# Altium project LC79D_GNSSreceiver.PrjPcb (part 3 of 3)
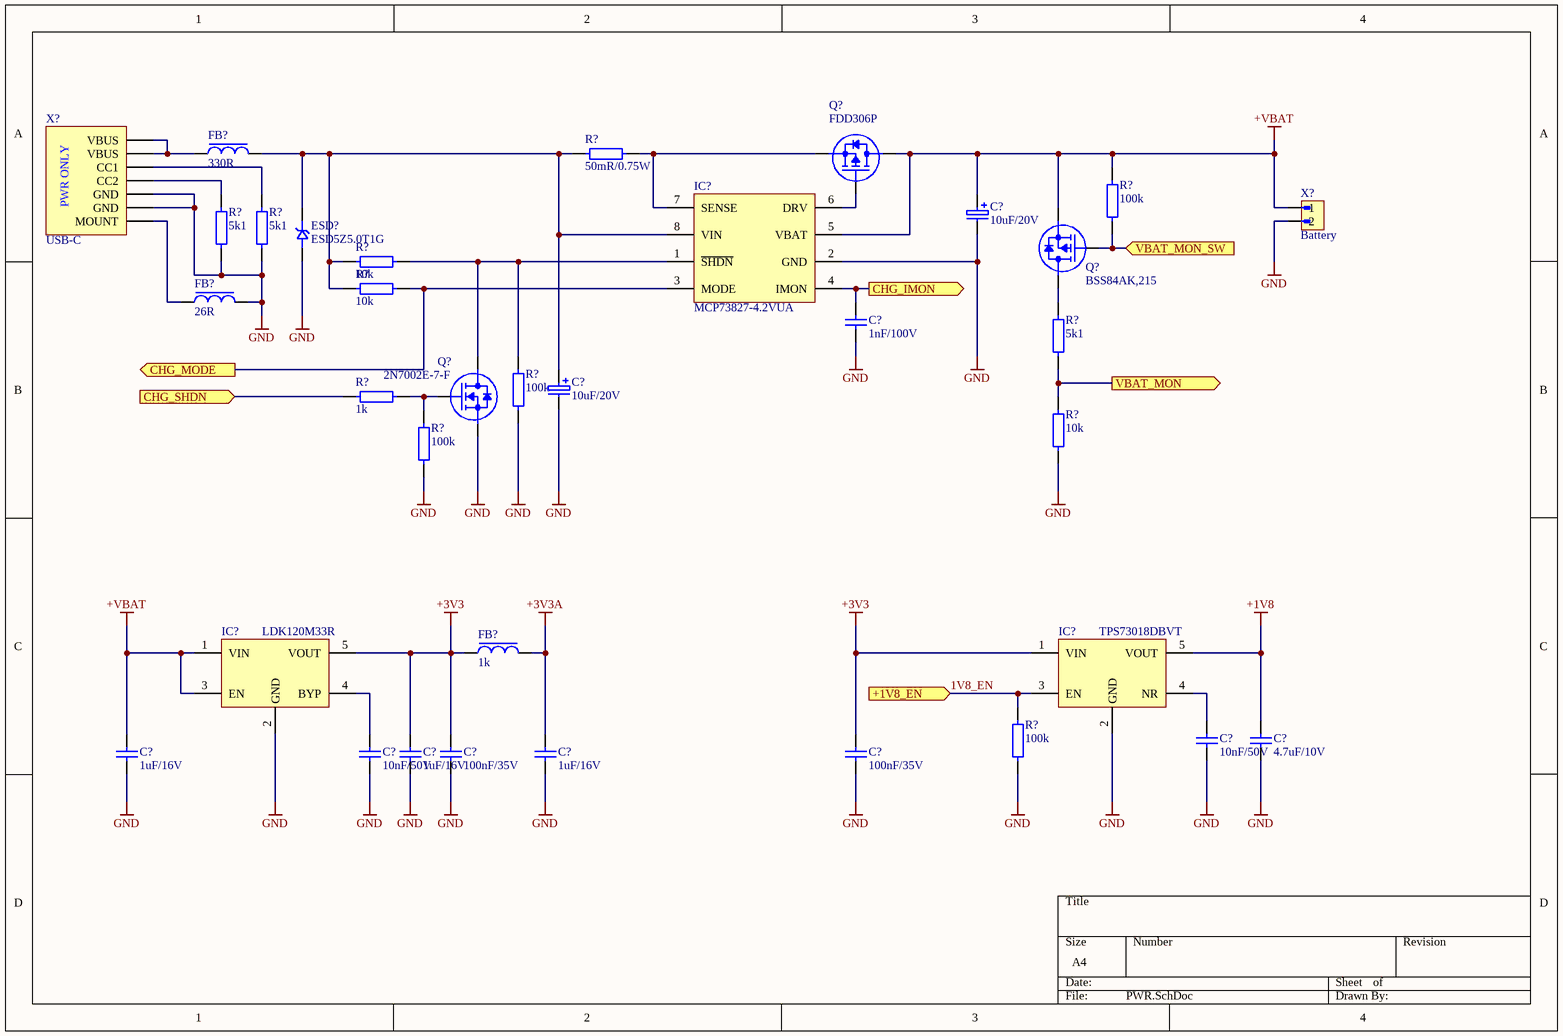
[diagram p4: PWR.SchDoc]

## Sheet PWR.SchDoc (continued)

### Library data of the parts (continued)
R?#13 = CR0603-FX-1001ELF: BOURNS - CR0603-FX-1001ELF - SMD Chip Resistor, 0603 [1608 Metric], 1 kohm, CR Series, 50 V, Thick Film, 100 mW; Manufacturer Series: CR0603; Resistance: 1kR; Tolerance: 1%; Temperature Coefficient: 100ppm/°C; Power Rating: 100mW; Voltage Rating: 50V; Manufacturer: Bourns; Manufacturer Part Number: CR0603-FX-1001ELF; RoHS: Yes; Category: Chip SMD Resistors; Stock 1: 461544; Pricing 1: 1=0,10000, 10=0,01700, 100=0,00680, 1000=0,00305, 2500=0,00264 (USD); Mount: Surface Mount; Case/Package: 0603; Number of Pins: 2; Contact Plating: Tin; Case Code (Metric): 1608; Case Code (Imperial): 0603; Package Shape: Rectangular; Size Code: 0603; Terminal Finish: Tin; Min Operating Temperature: -55°C; Max Operating Temperature: 155°C; Resistor Type: Thick Film; Packaging: Tape and Reel; Package Quantity: 1; Number of Terminations: 2; Termination: SMD/SMT; Max Power Dissipation: 100mW; Voltage Rating (DC): 50V; Features: Moisture Resistant; Series: CR0603; Resistance Tolerance: 1%; Technology: THICK FILM; Construction: Rectangular; Working Voltage: 50V; Length: 1.6mm; Width: 0.8mm; Height: 0.45mm; Depth: 0.8mm; Thickness: 457um; Radiation Hardening: No; REACH SVHC: No SVHC; Military Standard: Not; RoHS Compliant: Yes; ComponentLink1URL: https://datasheet.ciiva.com/11808/0900766b80fcdb72-11808035.pdf?src-supplier=RSComponents; ComponentLink1Description: https://datasheet.ciiva.com/11808/0900766b80fcdb72-11808035.pdf?src-supplier=RSComponents; ComponentLink2URL: https://datasheet.ciiva.com/19466/774882-19466523.pdf?src-supplier=Jameco; ComponentLink2Description: https://datasheet.ciiva.com/19466/774882-19466523.pdf?src-supplier=Jameco; ComponentLink3URL: https://datasheet.ciiva.com/6547/chpreztr-6547349.pdf?src-supplier=Digi-Key; ComponentLink3Description: https://datasheet.ciiva.com/6547/chpreztr-6547349.pdf?src-supplier=Digi-Key; ComponentLink4URL: https://datasheet.ciiva.com/16941/chpreztr-16941637.pdf?src-supplier=Avnet+Europe; ComponentLink4Description: https://datasheet.ciiva.com/16941/chpreztr-16941637.pdf?src-supplier=Avnet+Europe; ComponentLink5URL: https://datasheet.ciiva.com/22693/1902866-22693205.pdf?src-supplier=Element14; ComponentLink5Description: https://datasheet.ciiva.com/22693/1902866-22693205.pdf?src-supplier=Element14; ComponentLink6URL: https://datasheet.ciiva.com/6547/chpreztr-6547350.pdf?src-supplier=Digi-Key; ComponentLink6Description: https://datasheet.ciiva.com/6547/chpreztr-6547350.pdf?src-supplier=Digi-Key; ComponentLink7URL: https://datasheet.ciiva.com/7001/1902866-7001622.pdf?src-supplier=Newark; ComponentLink7Description: https://datasheet.ciiva.com/7001/1902866-7001622.pdf?src-supplier=Newark; ComponentLink8URL: https://datasheet.ciiva.com/30115/159chpreztr-30115222.pdf?src-supplier=Onlinecomponents.com; ComponentLink8Description: https://datasheet.ciiva.com/30115/159chpreztr-30115222.pdf?src-supplier=Onlinecomponents.com; ComponentLink9URL: https://datasheet.ciiva.com/6547/chpreztr-6547351.pdf?src-supplier=Digi-Key; ComponentLink9Description: https://datasheet.ciiva.com/6547/chpreztr-6547351.pdf?src-supplier=Digi-Key; ComponentLink10URL: https://datasheet.ciiva.com/16757/70154685-16757482.pdf?src-supplier=Allied+Electronics; ComponentLink10Description: https://datasheet.ciiva.com/16757/70154685-16757482.pdf?src-supplier=Allied+Electronics; ComponentLink11URL: https://datasheet.ciiva.com/5546/chpreztr-5546283.pdf?src-supplier=Mouser; ComponentLink11Description: https://datasheet.ciiva.com/5546/chpreztr-5546283.pdf?src-supplier=Mouser; ComponentLink12URL: https://datasheet.ciiva.com/7986/691949-7986156.pdf?src-supplier=Element14; ComponentLink12Description: https://datasheet.ciiva.com/7986/691949-7986156.pdf?src-supplier=Element14; ComponentLink13URL: https://datasheet.ciiva.com/3255/chpreztr-3255917.pdf?src-supplier=Avnet; ComponentLink13Description: https://datasheet.ciiva.com/3255/chpreztr-3255917.pdf?src-supplier=Avnet; Supplier 1: Digi-Key; Supplier 2: Mouser; Supplier 3: Farnell; Supplier Part Number 1: CR0603-FX-1001ELFCT-ND; Supplier Part Number 2: 652-CR0603FX-1001ELF; Supplier Part Number 3: 2691848
X?#1 = KUSBX-SMT-CS-6-BTR: USB Connectors USB TYPE C RCPT SMT 6PIN; Manufacturer: Kycon; Supplier 1: Mouser; Manufacturer Part Number: KUSBX-SMT-CS-6-BTR; RoHS: No; Stock 1: 580; Pricing 1: 1=0,86000, 10=0,68100, 50=0,68100, 100=0,59200, 1000=0,47300, 10000=0,38400 (USD); Supplier 2: Digi-Key; Supplier Part Number 1: 806-KUSBX-SMTCS6-BTR; Supplier Part Number 2: 2092-KUSBX-SMT-CS-6-BCT-ND
X?#2 = B2B-XH-A(LF)(SN): Conn Shrouded Header (4 Sides) HDR 2 POS 2.5mm Solder ST Thru-Hole Box; Manufacturer: JST; Number of Positions: 2; Connector Type: Male Pin; Contact Resistance: 20mR; Max Current Rating: 3A; Max Voltage Rating (AC): 250V; Insulation Resistance: 1GR; Wire/Cable Gauge: 22AWG; Supplier 1: Farnell; Manufacturer Part Number: B2B-XH-A(LF)(SN); RoHS: Yes; Category: FFC / FPC; Pricing 1: 100=0,071800, 1000=0,052000, 2500=0,048300, 5000=0,044500, 10000=0,043400 (GBP); Mount: Through Hole; Contact Plating: Tin,Copper,Lead; Color: Natural; Contact Material: Brass; Housing Material: Polyamide; Housing Color: White; Min Operating Temperature: -25°C; Max Operating Temperature: 85°C; Termination: Solder; Number of Rows: 1; Packaging: Bulk; Fastening Type: Detent; Orientation: Straight; Current Rating: 3A; Voltage Rating: 250V; Voltage Rating (AC): 250V; Number of Contacts: 2; Max Voltage Rating (DC): 250V; Length: 7.4mm; Pitch: 2.5mm; Depth: 5.75mm; Lead Pitch: 2.5mm; Lead Free: Lead Free; REACH SVHC: No SVHC; ComponentLink1URL: https://datasheet.ciiva.com/26894/getdatasheetpartid-640357-26894434.pdf?src-supplier=Verical; ComponentLink1Description: https://datasheet.ciiva.com/26894/getdatasheetpartid-640357-26894434.pdf?src-supplier=Verical; ComponentLink2URL: https://datasheet.ciiva.com/11746/0900766b8082653e-11746979.pdf?src-supplier=RSComponents; ComponentLink2Description: https://datasheet.ciiva.com/11746/0900766b8082653e-11746979.pdf?src-supplier=RSComponents; ComponentLink3URL: https://datasheet.ciiva.com/26894/getdatasheetpartid-385291-26894760.pdf?src-supplier=Verical; ComponentLink3Description: https://datasheet.ciiva.com/26894/getdatasheetpartid-385291-26894760.pdf?src-supplier=Verical; ComponentLink4URL: https://datasheet.ciiva.com/8052/5448-8052024.pdf?src-supplier=Element14; ComponentLink4Description: https://datasheet.ciiva.com/8052/5448-8052024.pdf?src-supplier=Element14; ComponentLink5URL: https://datasheet.ciiva.com/20207/523653-20207167.pdf?src-supplier=Rapid+Electronics; ComponentLink5Description: https://datasheet.ciiva.com/20207/523653-20207167.pdf?src-supplier=Rapid+Electronics; Supplier Part Number 1: 1516276

### Notes on the sheet
- (in symbol KUSBX-SMT-CS-6-BTR) PWR ONLY

## Sheet MCU.SchDoc
size A4; SheetNumber: 3; SheetTotal: 3
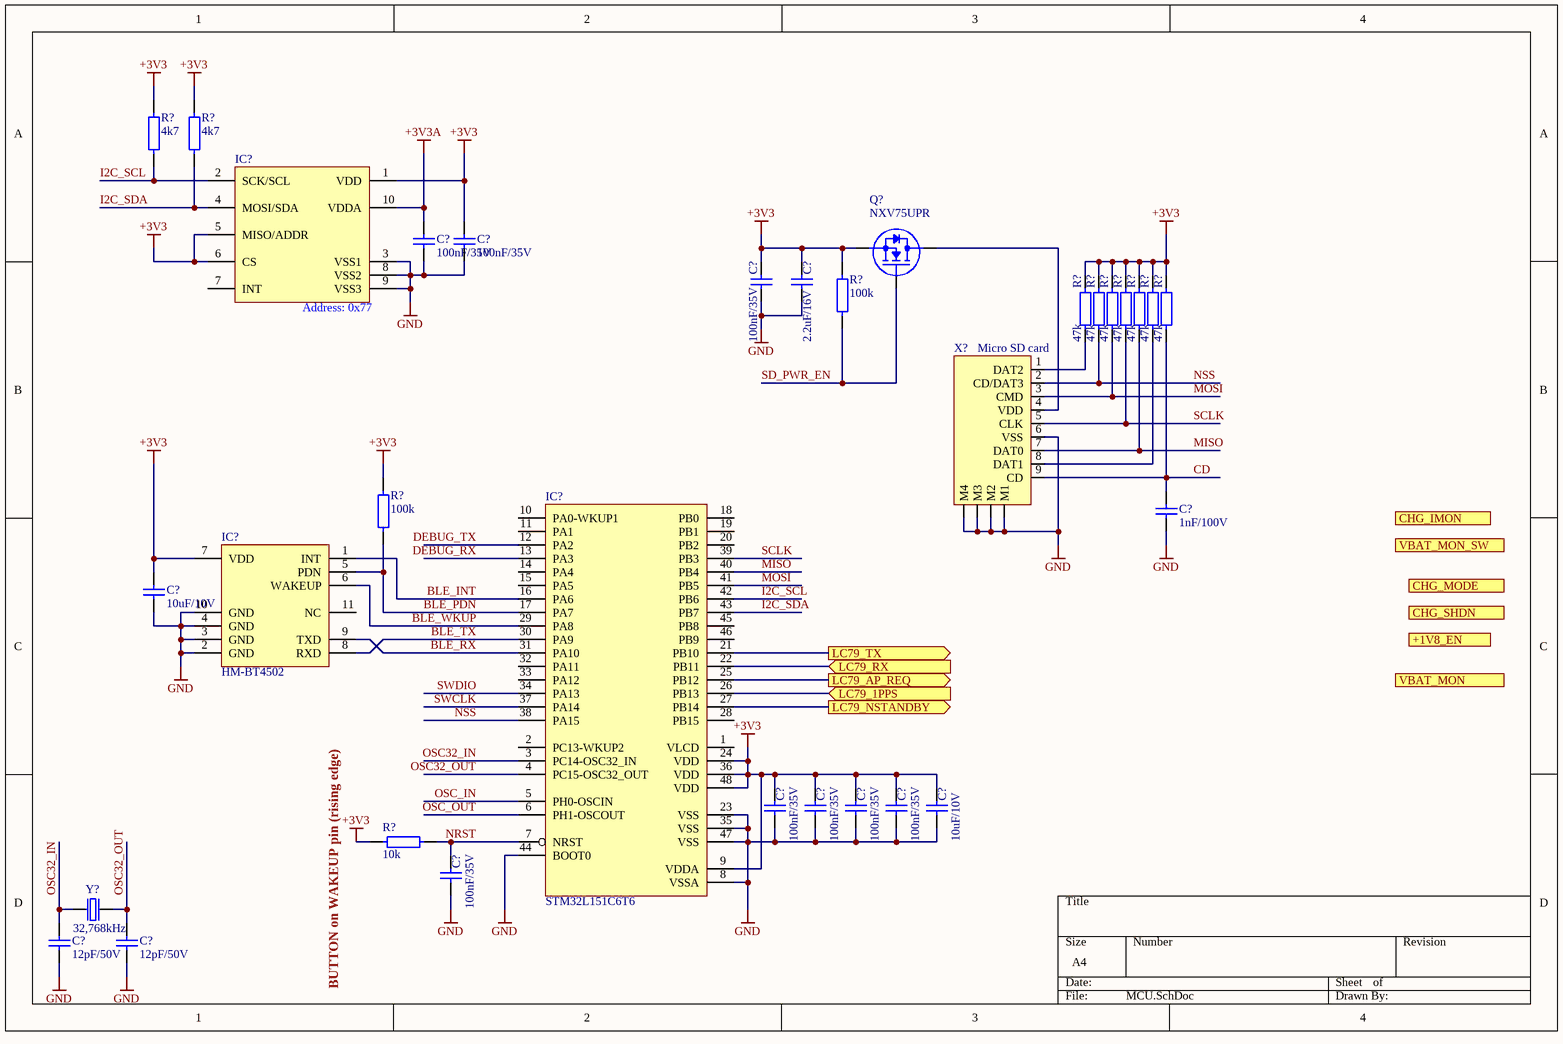
[diagram p2: MCU.SchDoc]

### Parts
(Parts that share a designator on the sheet are numbered #1, #2 ... from top to bottom, then left to right.)
C?#19  100nF/35V  [C0603]
C?#20  100nF/35V  [C0603]
C?#21  100nF/35V  [C0603]
C?#22  2.2uF/16V  [C0603]
C?#23  1nF/100V  [C0603]
C?#24  10uF/10V  [C0603]
C?#25  100nF/35V  [C0603]
C?#26  100nF/35V  [C0603]
C?#27  100nF/35V  [C0603]
C?#28  100nF/35V  [C0603]
C?#29  10uF/10V  [C0603]
C?#30  100nF/35V  [C0603]
C?#31  12pF/50V  [C0603]
C?#32  12pF/50V  [C0603]
IC?#6  (no value)  [LGA10]
IC?#7  STM32L151C6T6  [LQFP48]
IC?#8  HM-BT4502  [HM-BT450X]
Q?#5  NXV75UPR  [SOT23-3]
R?#18  4k7  [R0603]
R?#19  4k7  [R0603]
R?#20  100k  [R0603]
R?#21  47k  [R0603]
R?#22  47k  [R0603]
R?#23  47k  [R0603]
R?#24  47k  [R0603]
R?#25  47k  [R0603]
R?#26  47k  [R0603]
R?#27  47k  [R0603]
R?#28  100k  [R0603]
R?#29  10k  [r0603]
X?#3  Micro SD card  [MicroSD pull-slot]
Y?  32,768kHz  [FC135]

### Ports
+1V8_EN (in), CHG_IMON (out), CHG_MODE (out), CHG_SHDN (in), LC79_1PPS (in), LC79_AP_REQ (out), LC79_NSTANDBY (out), LC79_RX (in), LC79_TX (out), VBAT_MON (out), VBAT_MON_SW (in)

### Nets
+3V3: C?#20.2 C?#21.2 C?#22.2 C?#24.2 C?#25.2 C?#26.2 C?#27.2 C?#28.2 C?#29.2 IC?#6.1(VDD) IC?#6.5(MISO/ADDR) IC?#6.6(CS) IC?#7.9(VDDA) IC?#7.24(VDD) IC?#7.36(VDD) IC?#7.48(VDD) IC?#8.7(VDD) Q?#5.2(S) R?#18.1 R?#19.1 R?#20.1 R?#21.2 R?#22.2 R?#23.2 R?#24.2 R?#25.2 R?#26.2 R?#27.2 R?#28.2 R?#29.1
+3V3A: C?#19.2 IC?#6.10(VDDA)
GND: C?#19.1 C?#20.1 C?#21.1 C?#22.1 C?#23.1 C?#24.1 C?#25.1 C?#26.1 C?#27.1 C?#28.1 C?#29.1 C?#30.1 C?#31.1 C?#32.1 IC?#6.3(VSS1) IC?#6.8(VSS2) IC?#6.9(VSS3) IC?#7.8(VSSA) IC?#7.23(VSS) IC?#7.35(VSS) IC?#7.44(BOOT0) IC?#7.47(VSS) IC?#8.2(GND) IC?#8.3(GND) IC?#8.4(GND) IC?#8.10(GND) X?#3.6(VSS) X?#3.M1 X?#3.M2 X?#3.M3 X?#3.M4
BLE_INT: IC?#7.16(PA6) IC?#8.1(INT)
BLE_PDN: IC?#7.17(PA7) IC?#8.5(PDN) R?#28.1
BLE_RX: IC?#7.31(PA10) IC?#8.9(TXD)
BLE_TX: IC?#7.30(PA9) IC?#8.8(RXD)
BLE_WKUP: IC?#7.29(PA8) IC?#8.6(WAKEUP)
CD: C?#23.2 R?#27.1 X?#3.9(CD)
DEBUG_RX: IC?#7.13(PA3)
DEBUG_TX: IC?#7.12(PA2)
I2C_SCL: IC?#6.2(SCK/SCL) IC?#7.42(PB6) R?#18.2
I2C_SDA: IC?#6.4(MOSI/SDA) IC?#7.43(PB7) R?#19.2
LC79_1PPS: IC?#7.26(PB13) ; port LC79_1PPS
LC79_AP_REQ: IC?#7.25(PB12) ; port LC79_AP_REQ
LC79_NSTANDBY: IC?#7.27(PB14) ; port LC79_NSTANDBY
LC79_RX: IC?#7.22(PB11) ; port LC79_RX
LC79_TX: IC?#7.21(PB10) ; port LC79_TX
MISO: IC?#7.40(PB4) R?#25.1 X?#3.7(DAT0)
MOSI: IC?#7.41(PB5) R?#23.1 X?#3.3(CMD)
NRST: C?#30.2 IC?#7.7(NRST) R?#29.2
NSS: IC?#7.38(PA15) R?#22.1 X?#3.2(CD/DAT3)
OSC32_IN: C?#31.2 IC?#7.3(PC14-OSC32_IN) Y?.1
OSC32_OUT: C?#32.2 IC?#7.4(PC15-OSC32_OUT) Y?.2
OSC_IN: IC?#7.5(PH0-OSCIN)
OSC_OUT: IC?#7.6(PH1-OSCOUT)
SCLK: IC?#7.39(PB3) R?#24.1 X?#3.5(CLK)
SD_PWR_EN: Q?#5.1(G) R?#20.2
SWCLK: IC?#7.37(PA14)
SWDIO: IC?#7.34(PA13)
NetQ?#5_3: Q?#5.3(D) X?#3.4(VDD)
NetR?#21_1: R?#21.1 X?#3.1(DAT2)
NetR?#26_1: R?#26.1 X?#3.8(DAT1)

Not connected (* = marked no-connect by the designer): IC?#6 7(INT); IC?#7 1(VLCD) 2(PC13-WKUP2) 10(PA0-WKUP1) 11(PA1) 14(PA4) 15(PA5) 18(PB0) 19(PB1) 20(PB2) 28(PB15) 32(PA11) 33(PA12) 45(PB8) 46(PB9); IC?#8 11(NC)

### Notes on the sheet
- (near IC?#6) Address: 0x77
- (near R?#29) BUTTON on WAKEUP pin (rising edge)

### Library data of the parts
C?#19-C?#21 C?#25-C?#28 C?#30 = 06035G104ZAT2A: CERAMIC CAPACITOR, 0.1UF, 50V, Y5V, +80,-20%, 0603, FULL REEL; Product Range:-; Capacitance:0.1 F; Capacitance Tolerance:+80%, -20%; Dielectric Characteristic:Y5V; Voltage Rating:50V; Ceramic Capacitor Case:0603 [1608 Metric] ;RoHS Compliant: Yes; Manufacturer: Kyocera AVX; Capacitance: 100nF; Tolerance: 80%; Supplier 1: Farnell; Supplier Part Number 1: 2332660; Manufacturer Part Number: 06035G104ZAT2A; RoHS: Yes; Category: Ceramic Capacitors; Stock 1: 29140; Pricing 1: 10=0,03250, 100=0,02120, 500=0,01780, 1000=0,01420, 2000=0,01220 (GBP); Mount: Surface Mount,PCB; Case/Package: 0603; Number of Pins: 2; Case Code (Metric): 1608; Case Code (Imperial): 0603; Contact Plating: Tin,Matte; Dielectric Material: Ceramic; Min Operating Temperature: -30°C; Max Operating Temperature: 85°C; Dielectric: Y5V; Packaging: Tape and Reel; Voltage Rating (DC): 50V; Voltage Rating: 50V; Package Quantity: 1; Termination: SMD/SMT; Voltage: 50V; Series: -; Construction: Flat; Length: 1.6mm; Width: 0.032inch; Height: 0.63mm; Depth: 0.81mm; Thickness: 0.035inch; Radiation Hardening: No; REACH SVHC: No SVHC; Lead Free: Lead Free; RoHS Compliant: Yes; ComponentLink1URL: https://datasheet.ciiva.com/2987/cy5v-2987860.pdf?src-supplier=Avnet; ComponentLink1Description: https://datasheet.ciiva.com/2987/cy5v-2987860.pdf?src-supplier=Avnet; ComponentLink2URL: https://datasheet.ciiva.com/16359/cy5v-16359895.pdf?src-supplier=Future+Electronics; ComponentLink2Description: https://datasheet.ciiva.com/16359/cy5v-16359895.pdf?src-supplier=Future+Electronics; ComponentLink3URL: https://datasheet.ciiva.com/28613/578190-28613048.pdf?src-supplier=Element14; ComponentLink3Description: https://datasheet.ciiva.com/28613/578190-28613048.pdf?src-supplier=Element14; ComponentLink4URL: https://datasheet.ciiva.com/151/cy5v-151545.pdf?src-supplier=Digi-Key; ComponentLink4Description: https://datasheet.ciiva.com/151/cy5v-151545.pdf?src-supplier=Digi-Key; ComponentLink5URL: https://datasheet.ciiva.com/151/cy5v-151546.pdf?src-supplier=Digi-Key; ComponentLink5Description: https://datasheet.ciiva.com/151/cy5v-151546.pdf?src-supplier=Digi-Key; ComponentLink6URL: https://datasheet.ciiva.com/151/cy5v-151547.pdf?src-supplier=Digi-Key; ComponentLink6Description: https://datasheet.ciiva.com/151/cy5v-151547.pdf?src-supplier=Digi-Key; ComponentLink7URL: https://datasheet.ciiva.com/11499/cy5v-11499710.pdf?src-supplier=Avnet; ComponentLink7Description: https://datasheet.ciiva.com/11499/cy5v-11499710.pdf?src-supplier=Avnet; Supplier 2: Mouser; Supplier Part Number 2: 581-06035G104Z; Stock 2: 97036; Pricing 2: 1=0,09000, 10=0,03300, 50=0,03300, 100=0,02700, 1000=0,01600, 10000=0,01000 (USD); Supplier 3: Digi-Key; Supplier Part Number 3: 478-3724-6-ND; Stock 3: 629269; Pricing 3: 1=0,10000, 10=0,05900, 50=0,03220, 100=0,02640, 500=0,01882, 1000=0,01479 (USD)
C?#22 = C1608X5R1C225K080AB: TDK - C1608X5R1C225K080AB - SMD Multilayer Ceramic Capacitor, 2.2 µF, 16 V, 0603 [1608 Metric], ± 10%, X5R, C Series TDK; Capacitance: 2.2uF; Voltage Rating: 16V; Manufacturer: TDK; Manufacturer Part Number: C1608X5R1C225K080AB; RoHS: Yes; Category: Ceramic Capacitors; Stock 1: 107257; Pricing 1: 1=0,19000, 10=0,12900, 50=0,07760, 100=0,06560, 500=0,04484, 1000=0,03968 (USD); Mount: Surface Mount; Case/Package: 0603; Case Code (Metric): 1608; Case Code (Imperial): 0603; Dielectric Material: Ceramic; Weight: 7.1E-05oz; Min Operating Temperature: -55°C; Max Operating Temperature: 85°C; Tolerance: 10%; Dielectric: X5R; Packaging: Tape and Reel; Voltage Rating (DC): 16V; Termination: SMD/SMT; Package Quantity: 1; Resistor Type: Ceramic; Construction: Flat; Voltage: 16V; Series: C; Length: 1.6mm; Width: 0.031inch; Height: 0.8mm; Depth: 0.8mm; Thickness: 0.035inch; Radiation Hardening: No; REACH SVHC: No SVHC; Lead Free: Lead Free; RoHS Compliant: Yes; ComponentLink1URL: https://datasheet.ciiva.com/6251/tdkmlcccaprange-6251142.pdf?src-supplier=Digi-Key; ComponentLink1Description: https://datasheet.ciiva.com/6251/tdkmlcccaprange-6251142.pdf?src-supplier=Digi-Key; ComponentLink2URL: https://datasheet.ciiva.com/28577/mlcc-commercial-general-en-28577144.pdf?src-supplier=Element14; ComponentLink2Description: https://datasheet.ciiva.com/28577/mlcc-commercial-general-en-28577144.pdf?src-supplier=Element14; ComponentLink3URL: https://datasheet.ciiva.com/26285/13mlcc-commercial-general-en-26285227.pdf?src-supplier=Onlinecomponents.com; ComponentLink3Description: https://datasheet.ciiva.com/26285/13mlcc-commercial-general-en-26285227.pdf?src-supplier=Onlinecomponents.com; ComponentLink4URL: https://datasheet.ciiva.com/22725/1913358-22725516.pdf?src-supplier=Element14; ComponentLink4Description: https://datasheet.ciiva.com/22725/1913358-22725516.pdf?src-supplier=Element14; ComponentLink5URL: https://datasheet.ciiva.com/17487/e412-c-17487517.pdf?src-supplier=Avnet+Europe; ComponentLink5Description: https://datasheet.ciiva.com/17487/e412-c-17487517.pdf?src-supplier=Avnet+Europe; ComponentLink6URL: https://datasheet.ciiva.com/23802/1796654-23802766.pdf?src-supplier=Newark; ComponentLink6Description: https://datasheet.ciiva.com/23802/1796654-23802766.pdf?src-supplier=Newark; ComponentLink7URL: https://datasheet.ciiva.com/7975/1796654-7975071.pdf?src-supplier=Element14; ComponentLink7Description: https://datasheet.ciiva.com/7975/1796654-7975071.pdf?src-supplier=Element14; Supplier 1: Digi-Key; Supplier 2: Mouser; Supplier 3: Farnell; Supplier Part Number 1: 445-5157-1-ND; Supplier Part Number 2: 810-C1608X5R1C225K-4; Supplier Part Number 3: 2211169
C?#23 = 06031C102KAT2A: Cap MLCC SMD 0603 100V X7R 1000pF 10% Commercial Ti/Sn Plated 7"T/R; Manufacturer: Kyocera AVX; Dielectric Material: Ceramic; Capacitance: 1nF; Insulation Resistance: 100GR; Dissipation Factor: 2.5%; Supplier 1: Farnell; Supplier Part Number 1: 1833874; Manufacturer Part Number: 06031C102KAT2A; RoHS: Yes; Category: Ceramic Capacitors; Stock 1: 21717; Pricing 1: 10=0,05170, 100=0,04240, 500=0,02740, 1000=0,02080, 2000=0,01750, 4000=0,01420, 20000=0,01240 (GBP); Mount: Surface Mount,PCB; Case/Package: 0603; Number of Pins: 2; Case Code (Imperial): 0603; Case Code (Metric): 1608; Contact Plating: Tin,Matte; Min Operating Temperature: -55°C; Max Operating Temperature: 125°C; Tolerance: 10%; Dielectric: X7R; Packaging: Tape and Reel; Voltage Rating (DC): 100V; Voltage Rating: 100V; Package Quantity: 1; Termination: SMD/SMT; Voltage: 100V; Length: 1.6mm; Width: 0.81mm; Height: 0.9mm; Depth: 0.81mm; Thickness: 0.035inch; Radiation Hardening: No; REACH SVHC: No SVHC; Lead Free: Lead Free; ComponentLink1URL: https://datasheet.ciiva.com/2987/cx7r-2987733.pdf?src-supplier=Avnet; ComponentLink1Description: https://datasheet.ciiva.com/2987/cx7r-2987733.pdf?src-supplier=Avnet; ComponentLink2URL: https://datasheet.ciiva.com/7855/84526-7855189.pdf?src-supplier=Element14; ComponentLink2Description: https://datasheet.ciiva.com/7855/84526-7855189.pdf?src-supplier=Element14; ComponentLink3URL: https://datasheet.ciiva.com/11499/cx7r-11499669.pdf?src-supplier=Avnet; ComponentLink3Description: https://datasheet.ciiva.com/11499/cx7r-11499669.pdf?src-supplier=Avnet; ComponentLink4URL: https://datasheet.ciiva.com/1124/1679506-1124198.pdf?src-supplier=Element14; ComponentLink4Description: https://datasheet.ciiva.com/1124/1679506-1124198.pdf?src-supplier=Element14; ComponentLink5URL: https://datasheet.ciiva.com/16289/cx7r-16289400.pdf?src-supplier=Future+Electronics; ComponentLink5Description: https://datasheet.ciiva.com/16289/cx7r-16289400.pdf?src-supplier=Future+Electronics; ComponentLink6URL: https://datasheet.ciiva.com/5422/cx7r-218113-5422905.pdf?src-supplier=Mouser; ComponentLink6Description: https://datasheet.ciiva.com/5422/cx7r-218113-5422905.pdf?src-supplier=Mouser; ComponentLink7URL: https://datasheet.ciiva.com/7855/1679506-7855033.pdf?src-supplier=Element14; ComponentLink7Description: https://datasheet.ciiva.com/7855/1679506-7855033.pdf?src-supplier=Element14; ComponentLink8URL: https://datasheet.ciiva.com/150/cx7r-150395.pdf?src-supplier=Digi-Key; ComponentLink8Description: https://datasheet.ciiva.com/150/cx7r-150395.pdf?src-supplier=Digi-Key; ComponentLink9URL: https://datasheet.ciiva.com/22693/1679506-22693579.pdf?src-supplier=Element14; ComponentLink9Description: https://datasheet.ciiva.com/22693/1679506-22693579.pdf?src-supplier=Element14; ComponentLink10URL: https://datasheet.ciiva.com/150/cx7r-150396.pdf?src-supplier=Digi-Key; ComponentLink10Description: https://datasheet.ciiva.com/150/cx7r-150396.pdf?src-supplier=Digi-Key; ComponentLink11URL: https://datasheet.ciiva.com/14600/70001075-14600988.pdf?src-supplier=Allied+Electronics; ComponentLink11Description: https://datasheet.ciiva.com/14600/70001075-14600988.pdf?src-supplier=Allied+Electronics; ComponentLink12URL: https://datasheet.ciiva.com/150/cx7r-150397.pdf?src-supplier=Digi-Key; ComponentLink12Description: https://datasheet.ciiva.com/150/cx7r-150397.pdf?src-supplier=Digi-Key; ComponentLink13URL: https://datasheet.ciiva.com/14594/70001075-14594623.pdf?src-supplier=Allied+Electronics; ComponentLink13Description: https://datasheet.ciiva.com/14594/70001075-14594623.pdf?src-supplier=Allied+Electronics; ComponentLink14URL: https://datasheet.ciiva.com/16484/cx7r-16484383.pdf?src-supplier=Avnet+Asia; ComponentLink14Description: https://datasheet.ciiva.com/16484/cx7r-16484383.pdf?src-supplier=Avnet+Asia
C?#24 C?#29 = LMK107BBJ106MALT: TAIYO YUDEN - LMK107BBJ106MALT - CAPACITOR, MLCC, X5R, 10UF, 10V, 0603, REEL, FULL REEL; Tolerance: 20%; Supplier 1: Farnell; Supplier Part Number 1: 2113070; Manufacturer: Taiyo Yuden; Manufacturer Part Number: LMK107BBJ106MALT; RoHS: Yes; Category: Ceramic Capacitors; Stock 1: 9135; Pricing 1: 10=0,08050, 100=0,04970, 500=0,03510, 1000=0,03060, 2000=0,02970, 4000=0,02430, 20000=0,01840 (GBP); Mount: Surface Mount; Case/Package: 0603; Case Code (Imperial): 0603; Case Code (Metric): 1608; Min Operating Temperature: -55°C; Max Operating Temperature: 85°C; Termination: SMD/SMT; Resistor Type: Ceramic; Package Quantity: 1; Voltage Rating: 10V; Voltage Rating (DC): 10V; Packaging: Tape and Reel; Capacitance: 10uF; Dielectric: X5R; Voltage: 10V; Length: 1.6mm; Width: 0.8mm; Height: 0.8mm; Thickness: 0.035inch; Depth: 0.8mm; Radiation Hardening: No; REACH SVHC: Unknown; Lead Free: Lead Free; ComponentLink1URL: https://datasheet.ciiva.com/11596/lmk107bbj106malt-ss-11596989.pdf?src-supplier=Avnet; ComponentLink1Description: https://datasheet.ciiva.com/11596/lmk107bbj106malt-ss-11596989.pdf?src-supplier=Avnet; ComponentLink2URL: https://datasheet.ciiva.com/26872/getdatasheetpartid-637524-26872634.pdf?src-supplier=Verical; ComponentLink2Description: https://datasheet.ciiva.com/26872/getdatasheetpartid-637524-26872634.pdf?src-supplier=Verical
C?#31 C?#32 = C0603C120J5GACTU: Capacitor; Ceramic; Cap; 12.0pF; Tol 5%; SMT; Vol-Rtg 50V; C0G; Manufacturer: KEMET; Capacitance: 12pF; Temperature Coefficient: 30ppm/°C; Supplier 1: Digi-Key; Manufacturer Part Number: C0603C120J5GACTU; RoHS: Yes; Category: Ceramic Capacitors; Stock 1: 65599; Pricing 1: 1=0,10000, 10=0,05600, 50=0,03040, 100=0,02480, 500=0,01772, 1000=0,01392 (USD); Mount: Surface Mount,PCB; Case/Package: 0603; Number of Pins: 2; Dielectric Material: Ceramic; Contact Material: Tin; Case Code (Imperial): 0603; Case Code (Metric): 1608; Weight: 7.1E-05oz; Min Operating Temperature: -55°C; Max Operating Temperature: 125°C; Tolerance: 5%; Packaging: Tape and Reel; Dielectric: C0G; Voltage: 50V; Termination: SMD/SMT; Voltage Rating (DC): 50V; Package Quantity: 1; Series: C; Voltage Rating: 50V; Construction: Flat; Length: 1.6mm; Width: 0.8mm; Height: 0.8mm; Depth: 0.8mm; Thickness: 0.034inch; Lead Pitch: 0.7mm; Radiation Hardening: No; Lead Free: Lead Free; REACH SVHC: No SVHC; ComponentLink1URL: https://datasheet.ciiva.com/28608/1372242-28608539.pdf?src-supplier=Element14; ComponentLink1Description: https://datasheet.ciiva.com/28608/1372242-28608539.pdf?src-supplier=Element14; Supplier 2: Mouser; Supplier 3: Farnell; Supplier 4: TME; Supplier Part Number 1: 399-1050-1-ND; Supplier Part Number 2: 80-C0603C120J5G; Supplier Part Number 3: 1414612; Supplier Part Number 4: C0603C120J5GAC
IC?#6 = BMP384: Board Mount Absolute Pressure Sensor, LGA10; Manufacturer: Bosch Tools; Supplier 1: Mouser; Manufacturer Part Number: BMP384; RoHS: No; Stock 1: 11593; Pricing 1: 1=4,49000, 10=3,97000, 25=3,22000, 50=2,85000, 100=2,77000, 500=2,61000, 1000=2,53000, 10000=1,85000 (USD); Supplier 2: Digi-Key; Supplier Part Number 1: 262-BMP384; Supplier Part Number 2: 828-BMP384CT-ND
IC?#7 = STM32L151C6T6: STMICROELECTRONICS - STM32L151C6T6 - MCU, 32BIT, CORTEX-M3, 32MHZ, LQFP-48; Interface: I2C,SPI,USB,IrDA,UART,USART,LIN; Number of I/Os: 37; Oscillator Type: Internal; Memory Type: FLASH; Memory Size: 32KB; Peripherals: Brown-out Detect/Reset,POR,PWM,WDT,DMA,I2C; Core Architecture: ARM; RAM Size: 10KB; Max Supply Voltage: 3.6V; Min Supply Voltage: 1.65V; Number of Timers/Counters: 8; Data Bus Width: 32b; Watchdog Timer: Yes; Max Power Dissipation: 339mW; Number of PWM Channels: 1; Number of ADC Channels: 14; Number of SPI Channels: 2; Supplier 1: Mouser; Manufacturer: STMicroelectronics; Manufacturer Part Number: STM32L151C6T6; RoHS: Yes; Category: Microcontrollers; Pricing 1: 1=4,76000, 10=4,28000, 50=4,05000, 100=3,51000, 1000=2,52000, 10000=2,39000 (USD); Case/Package: LQFP; Number of Pins: 48; Min Operating Temperature: -40°C; Max Operating Temperature: 85°C; Frequency: 32MHz; Packaging: Tray; Package Quantity: 250; Number of Programmable I/O: 37; Max Frequency: 32MHz; Series: STM32 L1; Number of USB Channels: 1; Number of I2C Channels: 2; Length: 9.2mm; Width: 9.2mm; Height: 1.45mm; Radiation Hardening: No; RoHS Compliant: Yes; REACH SVHC: No SVHC; Lead Free: Lead Free; ComponentLink1URL: https://datasheet.ciiva.com/16490/cd00277537-16490959.pdf?src-supplier=Future+Electronics; ComponentLink1Description: https://datasheet.ciiva.com/16490/cd00277537-16490959.pdf?src-supplier=Future+Electronics; ComponentLink2URL: https://datasheet.ciiva.com/48688/001075537-da-01-en-mcu-32bt-32kb-stm32l151c6t6-lqfp-48-stm-48688197.pdf?src-supplier=Conrad; ComponentLink2Description: https://datasheet.ciiva.com/48688/001075537-da-01-en-mcu-32bt-32kb-stm32l151c6t6-lqfp-48-stm-48688197.pdf?src-supplier=Conrad; Supplier 2: Farnell; Supplier 3: TME; Supplier Part Number 1: 511-STM32L151C6T6; Supplier Part Number 2: 2060921; Supplier Part Number 3: STM32L151C6T6
IC?#8 = HM-BT4502: Bluetooth Low Energy (Pass through Module); Manufacturer: HopeRF; Supplier 1: SOS electronic; Manufacturer Part Number: HM-BT4502; RoHS: No; Stock 1: 12; Pricing 1: 1=2,05000, 2=2,00000, 5=1,94000, 64=1,79000, 128=1,76000 (EUR); Supplier Part Number 1: HM-BT4502
Q?#5 = NXV75UPR: Transistor MOSFET P-Channel 20V 1.8A 3-pin SOT-23; Manufacturer: Nexperia; Supplier 1: Farnell; Manufacturer Part Number: NXV75UPR; RoHS: No; Pricing 1: 5=0,39200, 10=0,30500, 100=0,17400, 500=0,11500 (GBP); Supplier 2: Mouser; Supplier 3: Digi-Key; Supplier Part Number 1: 3617844; Supplier Part Number 2: 771-NXV75UPR; Supplier Part Number 3: 1727-NXV75UPRCT-ND
R?#18 R?#19 = CR0603-FX-4701ELF: BOURNS - CR0603-FX-4701ELF - RES, 4K7, 1%, 0.1W, 0603, THICK FILM; Resistance: 4.7kR; Temperature Coefficient: 100ppm/°C; Power Rating: 100mW; Voltage Rating: 50V; Manufacturer: Bourns; Manufacturer Part Number: CR0603-FX-4701ELF; RoHS: Yes; Category: Chip SMD Resistors; Stock 1: 118416; Pricing 1: 1=0,10000, 10=0,01700, 100=0,00680, 1000=0,00305, 2500=0,00264 (USD); Mount: Surface Mount; Case/Package: 0603; Number of Pins: 2; Contact Plating: Tin; Case Code (Metric): 1608; Case Code (Imperial): 0603; Min Operating Temperature: -55°C; Max Operating Temperature: 155°C; Tolerance: 1%; Resistor Type: Thick Film; Package Quantity: 1; Packaging: Tape and Reel; Number of Terminations: 2; Termination: SMD/SMT; Max Power Dissipation: 100mW; Voltage Rating (DC): 50V; Features: Moisture Resistant; Series: CR0603; Resistance Tolerance: 1%; Technology: THICK FILM; Length: 1.6mm; Width: 0.8mm; Height: 0.45mm; Depth: 0.8mm; Thickness: 457um; Radiation Hardening: No; REACH SVHC: No SVHC; RoHS Compliant: Yes; ComponentLink1URL: https://datasheet.ciiva.com/11810/0900766b80fcdb72-11810558.pdf?src-supplier=RSComponents; ComponentLink1Description: https://datasheet.ciiva.com/11810/0900766b80fcdb72-11810558.pdf?src-supplier=RSComponents; ComponentLink2URL: https://datasheet.ciiva.com/22734/1902866-22734169.pdf?src-supplier=Element14; ComponentLink2Description: https://datasheet.ciiva.com/22734/1902866-22734169.pdf?src-supplier=Element14; ComponentLink3URL: https://datasheet.ciiva.com/7986/1856384-7986170.pdf?src-supplier=Element14; ComponentLink3Description: https://datasheet.ciiva.com/7986/1856384-7986170.pdf?src-supplier=Element14; ComponentLink4URL: https://datasheet.ciiva.com/7660/1856384-7660955.pdf?src-supplier=Element14; ComponentLink4Description: https://datasheet.ciiva.com/7660/1856384-7660955.pdf?src-supplier=Element14; Supplier 1: Digi-Key; Supplier 2: Mouser; Supplier 3: Farnell; Supplier Part Number 1: CR0603-FX-4701ELFCT-ND; Supplier Part Number 2: 652-CR0603FX-4701ELF; Supplier Part Number 3: 2008340
R?#20 R?#28 = CR0603-FX-1003ELF: Bourns CR0603-FX Series Thick Film Surface Mount Fixed Resistor 0603 Case 100k 1% 0.1W 100ppm/C; Temperature Coefficient: 100ppm/°C; Resistance: 100kR; Voltage Rating (DC): 50V; Max Power Dissipation: 100mW; Manufacturer: Bourns; Manufacturer Part Number: CR0603-FX-1003ELF; RoHS: Yes; Category: Chip SMD Resistors; Stock 1: 282; Pricing 1: 1=0,10000, 10=0,01700, 100=0,00680, 1000=0,00305, 2500=0,00264 (USD); Mount: Surface Mount; Case/Package: 0603; Number of Pins: 2; Contact Plating: Tin; Case Code (Metric): 1608; Case Code (Imperial): 0603; Min Operating Temperature: -55°C; Max Operating Temperature: 155°C; Resistor Type: Thick Film; Tolerance: 1%; Number of Terminations: 2; Termination: SMD/SMT; Features: Moisture Resistant; Packaging: Tape and Reel; Power Rating: 100mW; Voltage Rating: 50V; Package Quantity: 1; Working Voltage: 50V; Length: 1.6mm; Width: 0.031inch; Height: 0.022inch; Depth: 0.8mm; Thickness: 457um; Radiation Hardening: No; REACH SVHC: No SVHC; Military Standard: Not; ComponentLink1URL: https://datasheet.ciiva.com/11808/0900766b80fcdb72-11808036.pdf?src-supplier=RSComponents; ComponentLink1Description: https://datasheet.ciiva.com/11808/0900766b80fcdb72-11808036.pdf?src-supplier=RSComponents; ComponentLink2URL: https://datasheet.ciiva.com/19466/1163741-19466516.pdf?src-supplier=Jameco; ComponentLink2Description: https://datasheet.ciiva.com/19466/1163741-19466516.pdf?src-supplier=Jameco; ComponentLink3URL: https://datasheet.ciiva.com/41449/001055485-da-01-en-smd-wid-cr0603-fx-1003elf-100k-ohm-1-10w-41449971.pdf?src-supplier=Conrad; ComponentLink3Description: https://datasheet.ciiva.com/41449/001055485-da-01-en-smd-wid-cr0603-fx-1003elf-100k-ohm-1-10w-41449971.pdf?src-supplier=Conrad; ComponentLink4URL: https://datasheet.ciiva.com/46385/691949-46385260.pdf?src-supplier=Element14; ComponentLink4Description: https://datasheet.ciiva.com/46385/691949-46385260.pdf?src-supplier=Element14; ComponentLink5URL: https://datasheet.ciiva.com/6547/chpreztr-6547309.pdf?src-supplier=Digi-Key; ComponentLink5Description: https://datasheet.ciiva.com/6547/chpreztr-6547309.pdf?src-supplier=Digi-Key; ComponentLink6URL: https://datasheet.ciiva.com/6547/chpreztr-6547310.pdf?src-supplier=Digi-Key; ComponentLink6Description: https://datasheet.ciiva.com/6547/chpreztr-6547310.pdf?src-supplier=Digi-Key; ComponentLink7URL: https://datasheet.ciiva.com/3255/chpreztr-3255919.pdf?src-supplier=Avnet; ComponentLink7Description: https://datasheet.ciiva.com/3255/chpreztr-3255919.pdf?src-supplier=Avnet; ComponentLink8URL: https://datasheet.ciiva.com/16782/70154685-16782911.pdf?src-supplier=Allied+Electronics; ComponentLink8Description: https://datasheet.ciiva.com/16782/70154685-16782911.pdf?src-supplier=Allied+Electronics; ComponentLink9URL: https://datasheet.ciiva.com/22693/1902866-22693207.pdf?src-supplier=Element14; ComponentLink9Description: https://datasheet.ciiva.com/22693/1902866-22693207.pdf?src-supplier=Element14; ComponentLink10URL: https://datasheet.ciiva.com/16941/chpreztr-16941643.pdf?src-supplier=Avnet+Europe; ComponentLink10Description: https://datasheet.ciiva.com/16941/chpreztr-16941643.pdf?src-supplier=Avnet+Europe; ComponentLink11URL: https://datasheet.ciiva.com/15159/getdatasheetpartid-57636-15159629.pdf?src-supplier=Verical; ComponentLink11Description: https://datasheet.ciiva.com/15159/getdatasheetpartid-57636-15159629.pdf?src-supplier=Verical; ComponentLink12URL: https://datasheet.ciiva.com/5546/chpreztr-5546894.pdf?src-supplier=Mouser; ComponentLink12Description: https://datasheet.ciiva.com/5546/chpreztr-5546894.pdf?src-supplier=Mouser; ComponentLink13URL: https://datasheet.ciiva.com/7986/1902866-7986158.pdf?src-supplier=Element14; ComponentLink13Description: https://datasheet.ciiva.com/7986/1902866-7986158.pdf?src-supplier=Element14; ComponentLink14URL: https://datasheet.ciiva.com/6547/chpreztr-6547311.pdf?src-supplier=Digi-Key; ComponentLink14Description: https://datasheet.ciiva.com/6547/chpreztr-6547311.pdf?src-supplier=Digi-Key; ComponentLink15URL: https://datasheet.ciiva.com/30120/159chpreztr-30120559.pdf?src-supplier=Onlinecomponents.com; ComponentLink15Description: https://datasheet.ciiva.com/30120/159chpreztr-30120559.pdf?src-supplier=Onlinecomponents.com; Supplier 1: Digi-Key; Supplier 2: Mouser; Supplier 3: Farnell; Supplier Part Number 1: CR0603-FX-1003ELFCT-ND; Supplier Part Number 2: 652-CR0603-FX-103ELF; Supplier Part Number 3: 2008342
R?#21-R?#27 = AC0603FR-0747KL: RES SMD 47K OHM 1% 1/10W 0603; Manufacturer: Yageo; Resistance: 47kR; Temperature Coefficient: 100ppm/°C; Power Rating: 100mW; Voltage Rating: 50V; Supplier 1: Mouser; Manufacturer Part Number: AC0603FR-0747KL; RoHS: Yes; Category: Chip SMD Resistors; Stock 1: 18433; Pricing 1: 1=0,10000, 10=0,02900, 50=0,02900, 100=0,01200, 1000=0,00600, 10000=0,00400 (USD); Case/Package: 0603; Contact Plating: Tin,Matte; Case Code (Imperial): 0603; Case Code (Metric): 1608; Weight: 7.1E-05oz; Min Operating Temperature: -55°C; Max Operating Temperature: 155°C; Tolerance: 1%; Resistor Type: Thick Film; Packaging: Tape and Reel; Number of Terminations: 2; Termination: SMD/SMT; Max Power Dissipation: 100mW; Features: Moisture Resistant,Automotive AEC-Q200; Series: AC; Construction: Rectangular; Length: 1.6mm; Width: 0.031inch; Height: 0.022inch; Depth: 0.8mm; Radiation Hardening: No; Military Standard: Not; Lead Free: Lead Free; RoHS Compliant: Yes; ComponentLink1URL: https://datasheet.ciiva.com/26862/getdatasheetpartid-725037-26862466.pdf?src-supplier=Verical; ComponentLink1Description: https://datasheet.ciiva.com/26862/getdatasheetpartid-725037-26862466.pdf?src-supplier=Verical; ComponentLink2URL: https://datasheet.ciiva.com/12576/pyu-ac-51-rohs-l-2-12576783.pdf?src-supplier=Mouser; ComponentLink2Description: https://datasheet.ciiva.com/12576/pyu-ac-51-rohs-l-2-12576783.pdf?src-supplier=Mouser; Supplier Part Number 1: 603-AC0603FR-0747KL
R?#29 = CR0603-FX-1002ELF: Thick Film Resistors 10K 1% 1/10W; Manufacturer: Bourns; Resistance: 10kR; Temperature Coefficient: 100ppm/°C; Power Rating: 100mW; Voltage Rating: 50V; Manufacturer Part Number: CR0603-FX-1002ELF; RoHS: Yes; Category: Chip SMD Resistors; Stock 1: 5832; Pricing 1: 1=0,10000, 10=0,01700, 100=0,00680, 1000=0,00305, 2500=0,00264 (USD); Mount: Surface Mount; Case/Package: 0603; Number of Pins: 2; Contact Plating: Tin; Case Code (Metric): 1608; Case Code (Imperial): 0603; Min Operating Temperature: -55°C; Max Operating Temperature: 155°C; Tolerance: 1%; Resistor Type: Thick Film; Packaging: Tape and Reel; Package Quantity: 5000; Number of Terminations: 2; Termination: SMD/SMT; Max Power Dissipation: 100mW; Voltage Rating (DC): 50V; Features: Moisture Resistant; Series: CR0603; Resistance Tolerance: 1%; Technology: THICK FILM; Construction: Rectangular; Length: 1.6mm; Width: 0.8mm; Height: 0.45mm; Depth: 0.8mm; Thickness: 457um; Radiation Hardening: No; REACH SVHC: No SVHC; Military Standard: Not; RoHS Compliant: Yes; ComponentLink1URL: https://datasheet.ciiva.com/11808/0900766b80fcdb72-11808032.pdf?src-supplier=RSComponents; ComponentLink1Description: https://datasheet.ciiva.com/11808/0900766b80fcdb72-11808032.pdf?src-supplier=RSComponents; ComponentLink2URL: https://datasheet.ciiva.com/27049/774903-27049975.pdf?src-supplier=Jameco; ComponentLink2Description: https://datasheet.ciiva.com/27049/774903-27049975.pdf?src-supplier=Jameco; ComponentLink3URL: https://datasheet.ciiva.com/22693/1902866-22693206.pdf?src-supplier=Element14; ComponentLink3Description: https://datasheet.ciiva.com/22693/1902866-22693206.pdf?src-supplier=Element14; ComponentLink4URL: https://datasheet.ciiva.com/7001/1902866-7001623.pdf?src-supplier=Newark; ComponentLink4Description: https://datasheet.ciiva.com/7001/1902866-7001623.pdf?src-supplier=Newark; ComponentLink5URL: https://datasheet.ciiva.com/16757/70154685-16757483.pdf?src-supplier=Allied+Electronics; ComponentLink5Description: https://datasheet.ciiva.com/16757/70154685-16757483.pdf?src-supplier=Allied+Electronics; ComponentLink6URL: https://datasheet.ciiva.com/22644/1849498-22644171.pdf?src-supplier=Element14; ComponentLink6Description: https://datasheet.ciiva.com/22644/1849498-22644171.pdf?src-supplier=Element14; ComponentLink7URL: https://datasheet.ciiva.com/16938/chpreztr-16938733.pdf?src-supplier=Avnet+Europe; ComponentLink7Description: https://datasheet.ciiva.com/16938/chpreztr-16938733.pdf?src-supplier=Avnet+Europe; ComponentLink8URL: https://datasheet.ciiva.com/3255/chpreztr-3255918.pdf?src-supplier=Avnet; ComponentLink8Description: https://datasheet.ciiva.com/3255/chpreztr-3255918.pdf?src-supplier=Avnet; ComponentLink9URL: https://datasheet.ciiva.com/5548/chpreztr-5548911.pdf?src-supplier=Mouser; ComponentLink9Description: https://datasheet.ciiva.com/5548/chpreztr-5548911.pdf?src-supplier=Mouser; Supplier 1: Digi-Key; Supplier 2: Digi-Key; Supplier 3: Mouser; Supplier Part Number 1: CR0603-FX-1002ELFCT-ND; Supplier Part Number 2: CR0603-FX-1002ELFDKR-ND; Supplier Part Number 3: 652-CR0603FX-1002ELF
X?#3 = SD-Card MICRO: ComponentLink1Description: Datasheet; ComponentLink1URL: https://datasheet.lcsc.com/szlcsc/2009111836_SOFNG-TF-015_C113206.pdf
Y? = Q13FC13500005 FC-135 32.768KHZ 12.5PF: EPSON - Q13FC13500005  FC-135 32.768KHZ 12.5PF - QUARZ, 32.768KHZ, 12.5PF, 3.2 X 2.5MM; Capacitance: 1.25E-11F; Supplier 1: Farnell; Supplier Part Number 1: 2471846; Manufacturer: Epson; Manufacturer Part Number: Q13FC13500005 FC-135 32.768KHZ 12.5PF; RoHS: No; Stock 1: 960; Pricing 1: 1=0,55700, 10=0,39200, 25=0,35100, 50=0,32700, 100=0,31000, 250=0,27900, 1250=0,23400 (GBP); Min Operating Temperature: -40°C; Max Operating Temperature: 85°C; Load Capacitance: 12.5pF; REACH SVHC: Unknown; ComponentLink1URL: http://www.farnell.com/datasheets/1825887.pdf?src-supplier=Farnell; ComponentLink1Description: http://www.farnell.com/datasheets/1825887.pdf?src-supplier=Farnell; ComponentLink2URL: http://www.farnell.com/datasheets/1825887.pdf?src-supplier=Element14; ComponentLink2Description: http://www.farnell.com/datasheets/1825887.pdf?src-supplier=Element14

## Nets that join several sheets
+1V8: LC79D (9 pins), PWR (C?#11.1 IC?#5.5)
+3V3: LC79D (C?#1.2 IC?#1.14), PWR (6 pins), MCU (30 pins)
+3V3A: PWR (C?#17.2 FB?#3.2), MCU (C?#19.2 IC?#6.10)
GND: LC79D (16 pins), PWR (26 pins), MCU (31 pins)
LC79_1PPS: LC79D (IC?#1.10), MCU (IC?#7.26)
LC79_AP_REQ: LC79D (IC?#1.11), MCU (IC?#7.25)
LC79_NSTANDBY: LC79D (R?#3.1), MCU (IC?#7.27)
LC79_RX: LC79D (IC?#1.12), MCU (IC?#7.22)
LC79_TX: LC79D (IC?#1.13), MCU (IC?#7.21)